# Altium schematic sheet current_sense.SchDoc
size Letter; CompanyName: Carnegie Mellon University; Organization: Carnegie Mellon University; Address1: Carnegie Mellon University; Address2: Robotics Institute; Address3: 5000 Forbes Ave., 4208 NSH; Address4: Pittsburgh, PA 15213; DocumentNumber: 4; Revision: 1.0; SheetNumber: 4; SheetTotal: 8; PageSetup: Record=PageOptions|CenterHorizontal=True|CenterVertical=True|PrintScale=1.00|XCorrection=1.00|YCorrection=1.00|PrintKind=0|BorderSize=5000000|LeftOffset=0|BottomOffset=0|Orientation=2|PaperLength=1000|PaperWidth=1000|Scale=100|PaperSource=7|PrintQuality=-4|MediaType=1|DitherType=10|PaperKind=Letter|PrintScaleMode=1
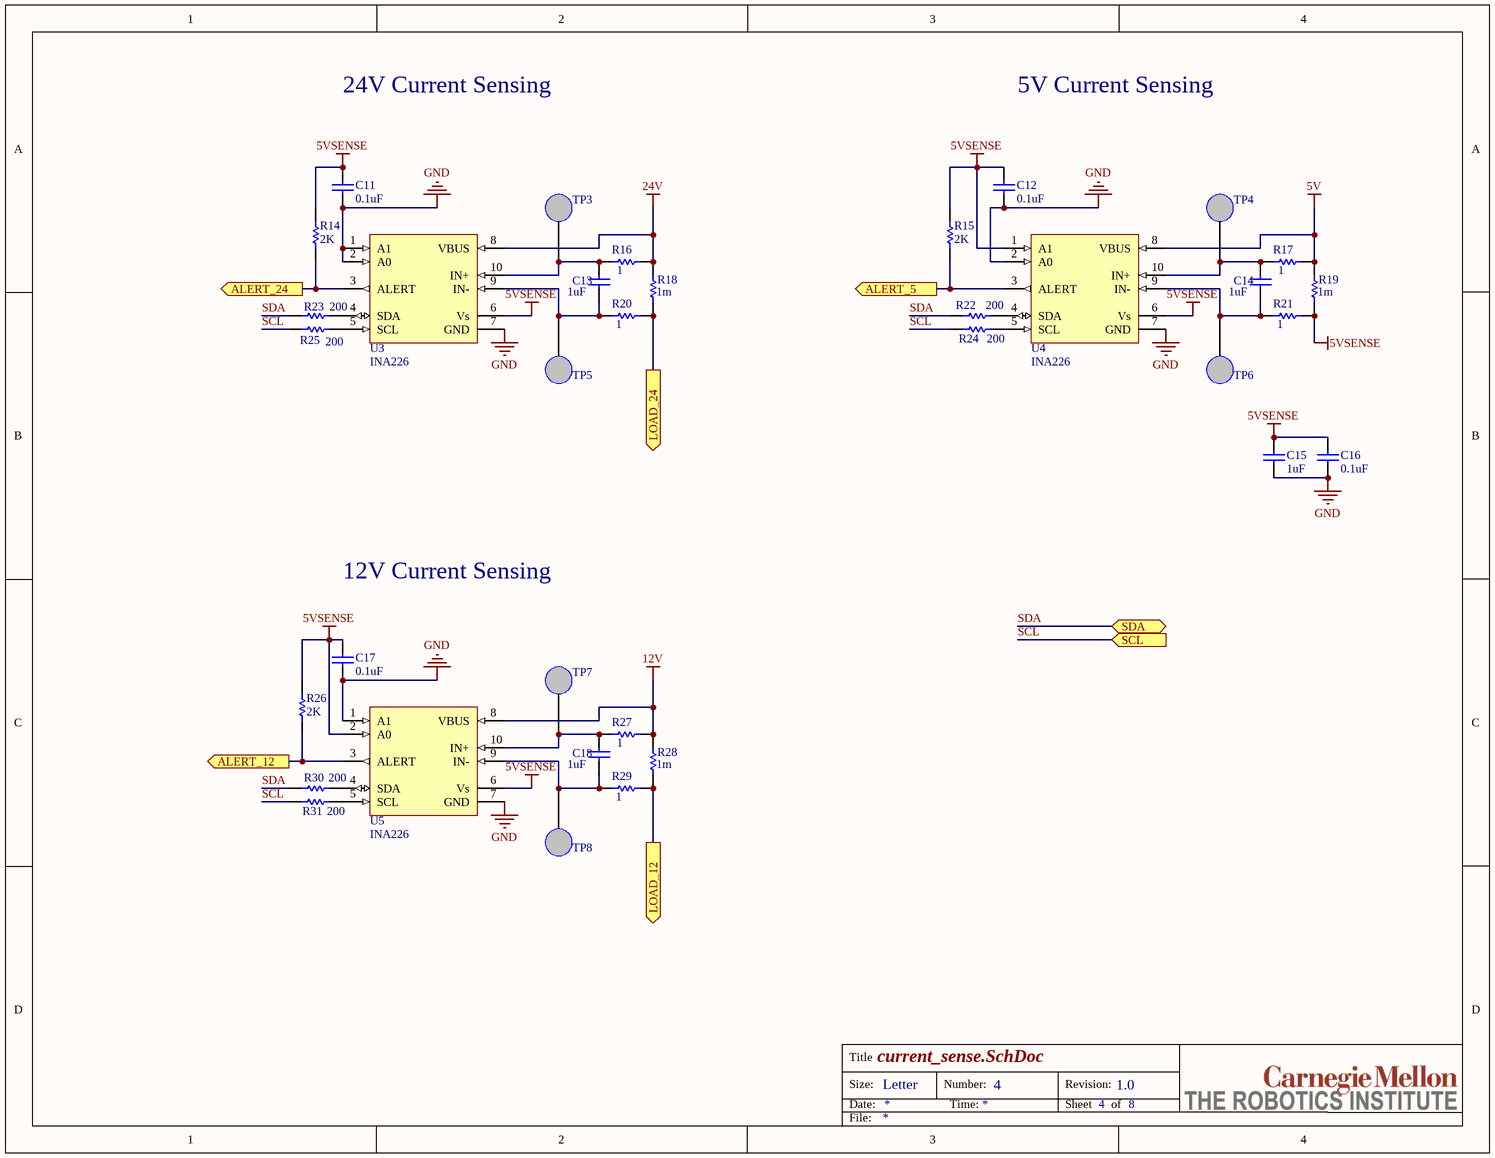
[diagram p0: current_sense.SchDoc]

## Parts
C11  value 0.1uF  [CAPC1608N]  (hidden comment: Bypass, 5V, 0.1uF)
C12  value 0.1uF  [CAPC1608N]  (hidden comment: Bypass, 5V, 0.1uF)
C13  1uF  [CAPC1608N]
C14  1uF  [CAPC1608N]
C15  value 1uF  [CAPC1608N]  (hidden comment: Bypass, 5V, 1uF)
C16  value 0.1uF  [CAPC1608N]  (hidden comment: Bypass, 5V, 0.1uF)
C17  value 0.1uF  [CAPC1608N]  (hidden comment: Bypass, 5V, 0.1uF)
C18  1uF  [CAPC1608N]
R14  2K  [RESC1608N]
R15  2K  [RESC1608N]
R16  1  [RESC1608N]
R17  1  [RESC1608N]
R18  value 1m  [RES5931]  (hidden comment: RSENSE, 24V, 1m)
R19  value 1m  [RESC3225N]  (hidden comment: RSENSE, 5V, 1m)
R20  1  [RESC1608N]
R21  1  [RESC1608N]
R22  200  [RESC1608N]
R23  200  [RESC1608N]
R24  200  [RESC1608N]
R25  200  [RESC1608N]
R26  2K  [RESC1608N]
R27  1  [RESC1608N]
R28  value 1m  [RESC3225N]  (hidden comment: RSENSE, 12V, 1m)
R29  1  [RESC1608N]
R30  200  [RESC1608N]
R31  200  [RESC1608N]
TP3  LOAD  [TestPoint]  (value not drawn)
TP4  SUPPLY  [TestPoint]  (value not drawn)
TP5  SUPPLY  [TestPoint]  (value not drawn)
TP6  LOAD  [TestPoint]  (value not drawn)
TP7  SUPPLY  [TestPoint]  (value not drawn)
TP8  LOAD  [TestPoint]  (value not drawn)
U3  INA226  [10-VSSOP]
U4  INA226  [10-VSSOP]
U5  INA226  [10-VSSOP]

## Ports
ALERT_5 (out), ALERT_12 (out), ALERT_24 (out), LOAD_12 (out), LOAD_24 (out), SCL (in), SDA (bidir)

## Nets
5V: R17.1 R19.2 U4.8(VBUS)
5VSENSE: C11.2 C12.2 C15.2 C16.2 C17.2 R14.1 R15.1 R19.1 R21.1 R26.1 U3.6(Vs) U4.1(A1) U4.6(Vs) U5.2(A0) U5.6(Vs)
12V: R27.1 R28.2 U5.8(VBUS)
24V: R16.1 R18.2 U3.8(VBUS)
GND: C11.1 C12.1 C15.1 C16.1 C17.1 U3.1(A1) U3.2(A0) U3.7(GND) U4.2(A0) U4.7(GND) U5.1(A1) U5.7(GND)
ALERT_5: R15.2 U4.3(ALERT) ; port ALERT_5
ALERT_12: R26.2 U5.3(ALERT) ; port ALERT_12
ALERT_24: R14.2 U3.3(ALERT) ; port ALERT_24
LOAD_12: R28.1 R29.1 ; port LOAD_12
LOAD_24: R18.1 R20.1 ; port LOAD_24
SCL: R24.2 R25.2 R31.2 ; port SCL
SDA: R22.2 R23.2 R30.2 ; port SDA
NetC13_1: C13.1 R16.2 TP3.1 U3.10(IN+)
NetC13_2: C13.2 R20.2 TP5.1 U3.9(IN-)
NetC14_1: C14.1 R17.2 TP4.1 U4.10(IN+)
NetC14_2: C14.2 R21.2 TP6.1 U4.9(IN-)
NetC18_1: C18.1 R27.2 TP7.1 U5.10(IN+)
NetC18_2: C18.2 R29.2 TP8.1 U5.9(IN-)
NetR22_1: R22.1 U4.4(SDA)
NetR23_1: R23.1 U3.4(SDA)
NetR24_1: R24.1 U4.5(SCL)
NetR25_1: R25.1 U3.5(SCL)
NetR30_1: R30.1 U5.4(SDA)
NetR31_1: R31.1 U5.5(SCL)

## Notes on the sheet
- 24V Current Sensing
- 5V Current Sensing
- 12V Current Sensing
- Title
- Size:
- Date:
- Letter
- Number:
- Time:
- Revision:
- Sheet
- of
- File:

## Library data of the parts
C11 C12 C16 C17 = Cap: Capacitor; Manufacturer: Murata Electronics North America; Manufacturer Part Number: GRM188R71H104JA93D; Description: CAP CER 0.1UF 50V X7R 0603; Capacitance: 0.10µF; Tolerance: ±5%; Voltage - Rated: 50V; Temperature Coefficient: X7R; Published: 8-Jun-2000; LatestRevisionDate: 17-Jul-2002; LatestRevisionNote: Re-released for DXP Platform.; PackageReference: RAD-0.3; Publisher: Altium Limited; PackageDescription: Radial Cap, Thru-Hole; 2 Leads; 0.3 in Pin Spacing; Supplier 1: Digi-Key; Supplier Part Number 1: 490-13406-1-ND; RoHS: RoHS Compliant; Category: Capacitors; Stock 1: 7465; Pricing 1: 1=0.11, 10=0.078, 50=0.0422, 100=0.0358, 250=0.02924, 500=0.02502, 1000=0.0195 (USD); Packaging: Cut Tape (CT); Mounting Type: Surface Mount, MLCC; Operating Temperature: -55°C ~ 125°C; Applications: General Purpose; Ratings: -; Package / Case: 0603 (1608 Metric); Size / Dimension: 0.063" L x 0.031" W (1.60mm x 0.80mm); Height - Seated (Max): -; Thickness (Max): 0.031" (0.80mm); Lead Spacing: -; Features: -; Lead Style: -; ComponentLink1URL: http://www.murata.com/~/media/webrenewal/support/library/catalog/products/capacitor/mlcc/c02e.pdf; ComponentLink1Description: http://www.murata.com/~/media/webrenewal/support/library/catalog/products/capacitor/mlcc/c02e.pdf
C13-C15 C18 = Cap: Capacitor; Manufacturer: Murata Electronics North America; Manufacturer Part Number: GRM188R61H105KAALD; Description: CAP CER 1UF 50V X5R 0603; Capacitance: 1µF; Tolerance: ±10%; Voltage - Rated: 50V; Temperature Coefficient: X5R; Published: 8-Jun-2000; LatestRevisionDate: 17-Jul-2002; LatestRevisionNote: Re-released for DXP Platform.; PackageReference: RAD-0.3; Publisher: Altium Limited; PackageDescription: Radial Cap, Thru-Hole; 2 Leads; 0.3 in Pin Spacing; Supplier 1: Digi-Key; Supplier Part Number 1: 490-10732-1-ND; RoHS: RoHS Compliant; Category: Capacitors; Stock 1: 59223; Pricing 1: 1=0.17, 10=0.12, 50=0.069, 100=0.057, 250=0.048, 500=0.0402, 1000=0.033 (USD); Packaging: Cut Tape (CT); Mounting Type: Surface Mount, MLCC; Operating Temperature: -55°C ~ 85°C; Applications: General Purpose; Ratings: -; Package / Case: 0603 (1608 Metric); Size / Dimension: 0.063" L x 0.031" W (1.60mm x 0.80mm); Height - Seated (Max): -; Thickness (Max): 0.035" (0.90mm); Lead Spacing: -; Features: -; Lead Style: -; ComponentLink1URL: http://www.murata.com/~/media/webrenewal/support/library/catalog/products/capacitor/mlcc/c02e.pdf; ComponentLink1Description: http://www.murata.com/~/media/webrenewal/support/library/catalog/products/capacitor/mlcc/c02e.pdf
  C13 C14 C18: Value: 1uF
R14 R15 R26 = Res1: Resistor; Manufacturer: Yageo; Manufacturer Part Number: RC0603JR-072KL; Description: RES SMD 2K OHM 5% 1/10W 0603; Tolerance: ±5%; Power (Watts): 0.1W, 1/10W; Temperature Coefficient: ±100ppm/°C; Published: 8-Jun-2000; LatestRevisionDate: 17-Jul-2002; LatestRevisionNote: Re-released for DXP Platform.; PackageReference: AXIAL-0.3; Publisher: Altium Limited; PackageDescription: Axial Device, Thru-Hole; 2 Leads; 0.3 in Pin Spacing; Value: 2K; Supplier 1: Digi-Key; Supplier Part Number 1: 311-2.0KGRCT-ND; RoHS: RoHS Compliant; Category: Resistors; Stock 1: 411222; Pricing 1: 1=0.1, 10=0.011, 25=0.008, 100=0.0044, 250=0.00336, 500=0.0027, 1000=0.00198, 2500=0.00172 (USD); Packaging: Cut Tape (CT); Resistance (Ohms): 2k; Composition: Thick Film; Features: Moisture Resistant; Operating Temperature: -55°C ~ 155°C; Package / Case: 0603 (1608 Metric); Supplier Device Package: 0603; Size / Dimension: 0.063" L x 0.031" W (1.60mm x 0.80mm); Height: 0.022" (0.55mm); Number of Terminations: 2; ComponentLink1URL: http://www.yageo.com/documents/recent/PYu-RC_Group_51_RoHS_L_04.pdf; ComponentLink1Description: http://www.yageo.com/documents/recent/PYu-RC_Group_51_RoHS_L_04.pdf
R16 R17 R20 R21 R27 R29 = Res1: Resistor; Manufacturer: Yageo; Manufacturer Part Number: RC0603FR-071RL; Description: RES SMD 1 OHM 1% 1/10W 0603; Tolerance: ±1%; Power (Watts): 0.1W, 1/10W; Temperature Coefficient: ±200ppm/°C; Published: 8-Jun-2000; LatestRevisionDate: 17-Jul-2002; LatestRevisionNote: Re-released for DXP Platform.; PackageReference: AXIAL-0.3; Publisher: Altium Limited; PackageDescription: Axial Device, Thru-Hole; 2 Leads; 0.3 in Pin Spacing; Value: 1; Supplier 1: Digi-Key; Supplier Part Number 1: 311-1.00HRCT-ND; RoHS: RoHS Compliant; Category: Resistors; Stock 1: 113321; Pricing 1: 1=0.1, 10=0.02, 25=0.0144, 100=0.0082, 250=0.00624, 500=0.00498, 1000=0.00367, 2500=0.00319 (USD); Packaging: Cut Tape (CT); Resistance (Ohms): 1; Composition: Thick Film; Features: Moisture Resistant; Operating Temperature: -55°C ~ 155°C; Package / Case: 0603 (1608 Metric); Supplier Device Package: 0603; Size / Dimension: 0.063" L x 0.031" W (1.60mm x 0.80mm); Height: 0.022" (0.55mm); Number of Terminations: 2; ComponentLink1URL: http://www.yageo.com/documents/recent/PYu-RC_Group_51_RoHS_L_04.pdf; ComponentLink1Description: http://www.yageo.com/documents/recent/PYu-RC_Group_51_RoHS_L_04.pdf
R18 = Res1: Resistor; Manufacturer: Rohm Semiconductor; Manufacturer Part Number: PSR500HTQFH1L00; Description: RES SMD 0.001 OHM 1% 5W 5931; Resistance (Ohms): 0.001; Tolerance: ±1%; Power (Watts): 5W; Temperature Coefficient: ±75ppm/°C; Published: 8-Jun-2000; LatestRevisionDate: 17-Jul-2002; LatestRevisionNote: Re-released for DXP Platform.; PackageReference: AXIAL-0.3; Publisher: Altium Limited; PackageDescription: Axial Device, Thru-Hole; 2 Leads; 0.3 in Pin Spacing; Supplier 1: Digi-Key; Supplier Part Number 1: RHM1683-CT-ND; RoHS: RoHS Compliant; Category: Resistors; Stock 1: 2625; Pricing 1: 1=1.96, 10=1.736, 25=1.61, 100=1.3259, 250=1.13652, 500=0.9471, 1000=0.82082 (USD); Packaging: Cut Tape (CT); Composition: Metal Element; Features: Automotive AEC-Q200, Current Sense; Operating Temperature: -55°C ~ 170°C; Package / Case: 5931; Supplier Device Package: 5931; Size / Dimension: 0.591" L x 0.305" W (15.00mm x 7.75mm); Height: -; Number of Terminations: 2; ComponentLink1URL: http://rohmfs.rohm.com/en/products/databook/datasheet/passive/resistor/chip_resistor/psr.pdf; ComponentLink1Description: http://rohmfs.rohm.com/en/products/databook/datasheet/passive/resistor/chip_resistor/psr.pdf
R19 R28 = Res1: Resistor; Manufacturer: Rohm Semiconductor; Manufacturer Part Number: PMR25HZPFV1L00; Description: RES SMD 0.001 OHM 1% 1W 1210; Resistance (Ohms): 0.001; Tolerance: ±1%; Power (Watts): 1W; Temperature Coefficient: ±100ppm/°C; Published: 8-Jun-2000; LatestRevisionDate: 17-Jul-2002; LatestRevisionNote: Re-released for DXP Platform.; PackageReference: AXIAL-0.3; Publisher: Altium Limited; PackageDescription: Axial Device, Thru-Hole; 2 Leads; 0.3 in Pin Spacing; Supplier 1: Digi-Key; Supplier Part Number 1: RHM.001APCT-ND; RoHS: RoHS Compliant; Category: Resistors; Stock 1: 2836; Pricing 1: 1=0.64, 10=0.535, 25=0.4588, 100=0.3593, 250=0.32108, 500=0.25994, 1000=0.21024 (USD); Packaging: Cut Tape (CT); Composition: Thick Film; Features: Automotive AEC-Q200, Current Sense; Operating Temperature: -55°C ~ 155°C; Package / Case: 1210 (3225 Metric); Supplier Device Package: 1210 (3225 Metric); Size / Dimension: 0.126" L x 0.098" W (3.20mm x 2.50mm); Height: 0.026" (0.67mm); Number of Terminations: 2; ComponentLink1URL: http://rohmfs.rohm.com/en/products/databook/datasheet/passive/resistor/chip_resistor/pmr.pdf; ComponentLink1Description: http://rohmfs.rohm.com/en/products/databook/datasheet/passive/resistor/chip_resistor/pmr.pdf
R22-R25 R30 R31 = Res1: Resistor; Manufacturer: Yageo; Manufacturer Part Number: RC0603JR-07200RL; Description: RES SMD 200 OHM 5% 1/10W 0603; Tolerance: ±5%; Power (Watts): 0.1W, 1/10W; Temperature Coefficient: ±100ppm/°C; Published: 8-Jun-2000; LatestRevisionDate: 17-Jul-2002; LatestRevisionNote: Re-released for DXP Platform.; PackageReference: AXIAL-0.3; Publisher: Altium Limited; PackageDescription: Axial Device, Thru-Hole; 2 Leads; 0.3 in Pin Spacing; Value: 200; Supplier 1: Digi-Key; Supplier Part Number 1: 311-200GRCT-ND; RoHS: RoHS Compliant; Category: Resistors; Stock 1: 267996; Pricing 1: 1=0.1, 10=0.011, 25=0.008, 100=0.0044, 250=0.00336, 500=0.0027, 1000=0.00198, 2500=0.00172 (USD); Packaging: Cut Tape (CT); Resistance (Ohms): 200; Composition: Thick Film; Features: Moisture Resistant; Operating Temperature: -55°C ~ 155°C; Package / Case: 0603 (1608 Metric); Supplier Device Package: 0603; Size / Dimension: 0.063" L x 0.031" W (1.60mm x 0.80mm); Height: 0.022" (0.55mm); Number of Terminations: 2; ComponentLink1URL: http://www.yageo.com/documents/recent/PYu-RC_Group_51_RoHS_L_04.pdf; ComponentLink1Description: http://www.yageo.com/documents/recent/PYu-RC_Group_51_RoHS_L_04.pdf
TP3-TP8 = Ring_Terminal: Test Point
U3-U5 = INA226: Current Shunt Monitor - I2C Interface; Manufacturer: Texas Instruments; Manufacturer Part Number: INA226AIDGSR; Description: IC MONITOR PWR/CURR BIDIR 10MSOP; Function: Current Monitor; Sensing Method: High/Low-Side; Accuracy: ±0.02%; Voltage - Input: 0 V ~ 36 V; Current - Output: 10mA; Supplier 1: Digi-Key; Supplier Part Number 1: 296-29034-1-ND; RoHS: RoHS Compliant; Category: Integrated Circuits (ICs); Stock 1: 16599; Pricing 1: 1=3.44, 10=3.087, 100=2.5326, 500=2.1546, 1000=1.575 (USD); Packaging: Cut Tape (CT); Operating Temperature: -40°C ~ 125°C; Mounting Type: Surface Mount; Package / Case: 10-TFSOP, 10-MSOP (0.118", 3.00mm Width); Supplier Device Package: 10-VSSOP; ComponentLink1URL: http://www.ti.com/lit/ds/symlink/ina226.pdf; ComponentLink1Description: http://www.ti.com/lit/ds/symlink/ina226.pdf